# EAGLE design ecl-gated-ring-osc (EAGLE 9.4.1)
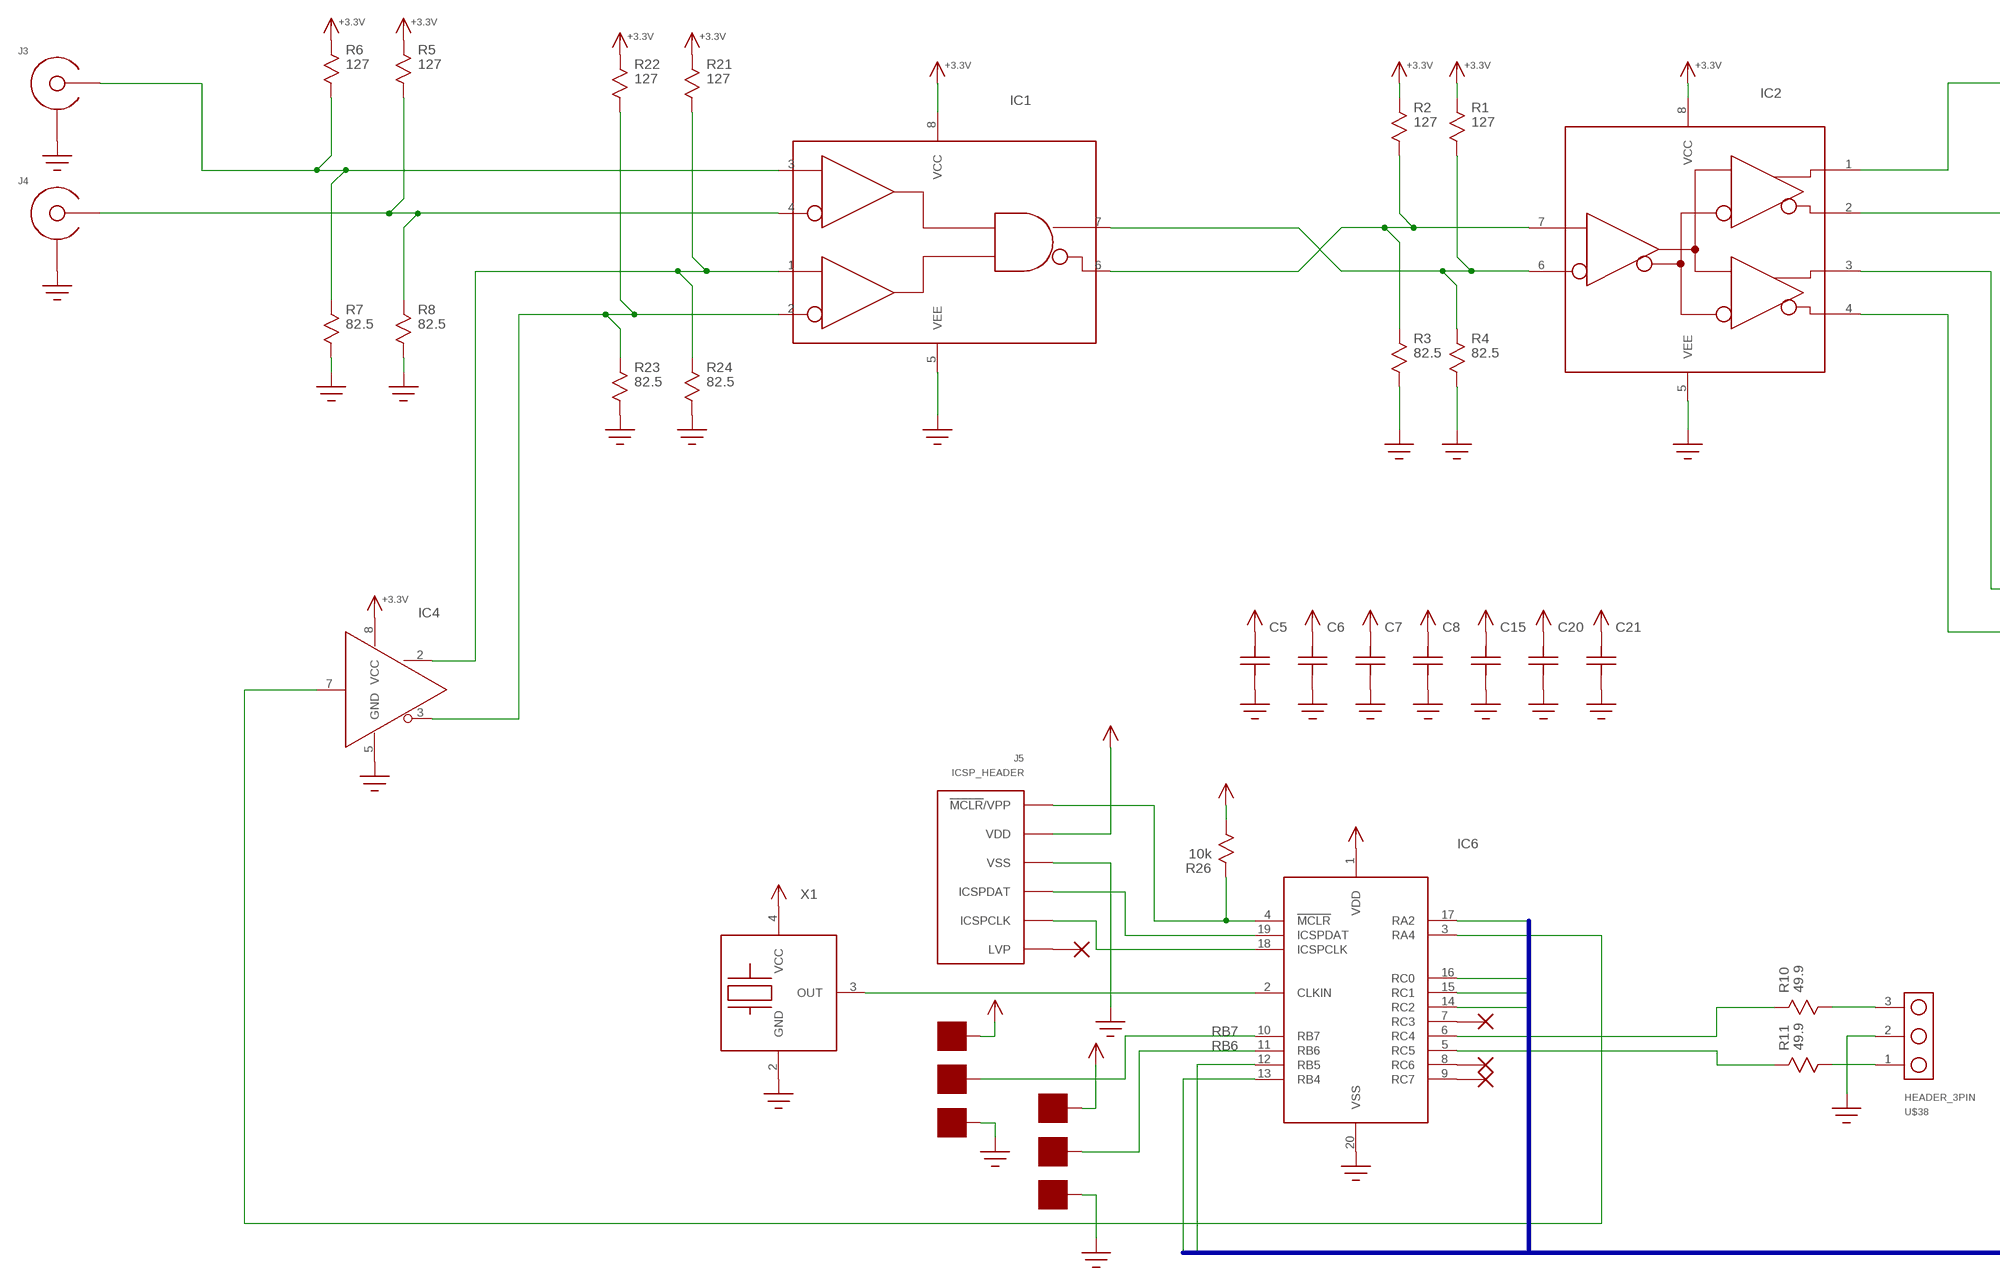
[diagram p0: schematic, sheet 1, part 1 of 2]
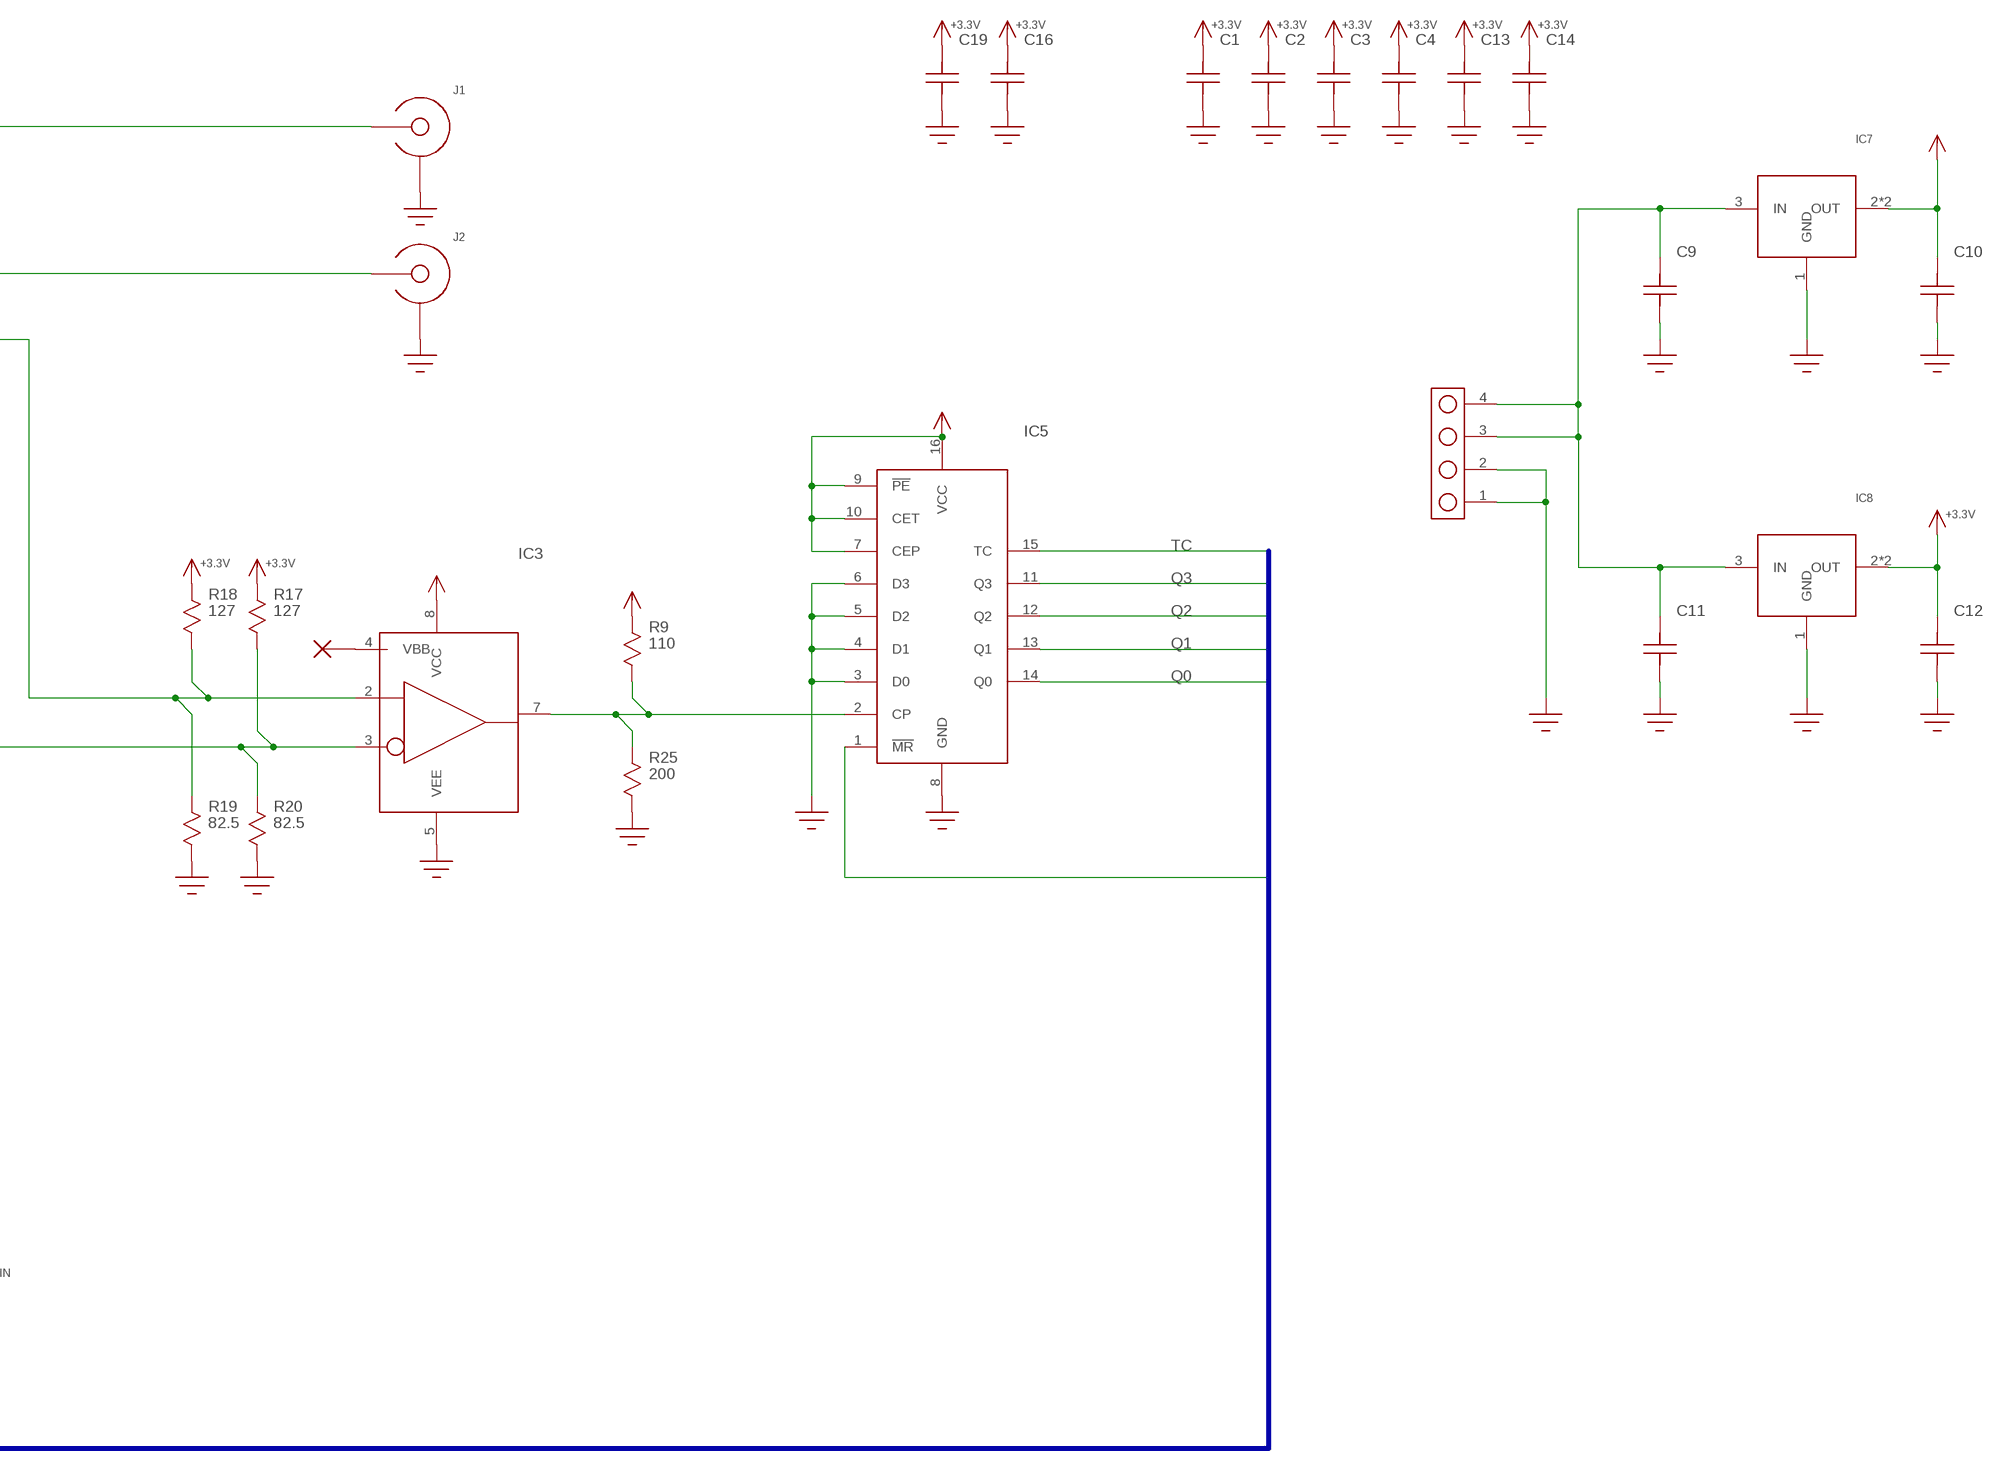
[diagram p1: schematic, sheet 1, part 2 of 2]

## Parts
C1  C0603  [C0603]
C2  C0603  [C0603]
C3  C0603  [C0603]
C4  C0603  [C0603]
C5  C0603  [C0603]
C6  C0603  [C0603]
C7  C0603  [C0603]
C8  C0603  [C0603]
C9  C1206  [1206]
C10  C1206  [1206]
C11  C1206  [1206]
C12  C1206  [1206]
C13  C0603  [C0603]
C14  C0603  [C0603]
C15  C0603  [C0603]
C16  C0603  [C0603]
C19  C0603  [C0603]
C20  C0603  [C0603]
C21  C0603  [C0603]
IC1  SY10EP05V  [SOIC8]
IC2  SY10EP11U  [SOIC8]
IC3  MC100EPT21  [SOIC8]
IC4  MC100LVELT20  [SOIC8]
IC5  74XX161  [SOIC-16]
IC6  PIC16F15345  [SOIC-20N]
IC7  AZ1117E  [SOT-223]
IC8  AZ1117E  [SOT-223]
J1  SMA-EDGE-LAUNCH4L-4020-TAPER-FIXED  [SMA_EDGE_LAUNCH_4L_4020_TAPER_FIXED]
J2  SMA-EDGE-LAUNCH4L-4020-TAPER-FIXED  [SMA_EDGE_LAUNCH_4L_4020_TAPER_FIXED]
J3  SMA-EDGE-LAUNCH4L-4020-TAPER-FIXED  [SMA_EDGE_LAUNCH_4L_4020_TAPER_FIXED]
J4  SMA-EDGE-LAUNCH4L-4020-TAPER-FIXED  [SMA_EDGE_LAUNCH_4L_4020_TAPER_FIXED]
J5  ICSP_HEADER  [HEADER_6PIN]
J6  HEADER_4PIN  [HEADER_4PIN]
R1  127  R0603  [R0603]
R2  127  R0603  [R0603]
R3  82.5  R0603  [R0603]
R4  82.5  R0603  [R0603]
R5  127  R0603  [R0603]
R6  127  R0603  [R0603]
R7  82.5  R0603  [R0603]
R8  82.5  R0603  [R0603]
R9  110  R0603  [R0603]
R10  49.9  R0603  [R0603]
R11  49.9  R0603  [R0603]
R17  127  R0603  [R0603]
R18  127  R0603  [R0603]
R19  82.5  R0603  [R0603]
R20  82.5  R0603  [R0603]
R21  127  R0603  [R0603]
R22  127  R0603  [R0603]
R23  82.5  R0603  [R0603]
R24  82.5  R0603  [R0603]
R25  200  R0603  [R0603]
R26  10k  R0603  [R0603]
U$38  HEADER_3PIN  [HEADER_3PIN]
U$73  PAD50MIL  [PAD_50MIL]
U$74  PAD50MIL  [PAD_50MIL]
U$75  PAD50MIL  [PAD_50MIL]
U$82  NO_CONNECT  (no package)
U$83  PAD50MIL  [PAD_50MIL]
U$84  PAD50MIL  [PAD_50MIL]
U$85  NO_CONNECT  (no package)
U$86  NO_CONNECT  (no package)
U$87  NO_CONNECT  (no package)
U$88  NO_CONNECT  (no package)
U$92  PAD50MIL  [PAD_50MIL]
X1  XTAL_OSC  [XTAL_3.2X5]

## Nets
!MR!: IC5.1(!MR!) IC6.12(RB5)
+3.3V: C1.P$2 C2.P$2 C3.P$2 C4.P$2 C12.P$2 C13.P$2 C14.P$2 C16.P$2 C19.P$2 IC1.8(VCC) IC2.8(VCC) IC4.8(VCC) IC8.2(OUT) IC8.4(OUT) R1.P$1 R2.P$1 R5.P$1 R6.P$1 R17.P$1 R18.P$1 R21.P$1 R22.P$1
GND: C1.P$1 C2.P$1 C3.P$1 C4.P$1 C5.P$1 C6.P$1 C7.P$1 C8.P$1 C9.P$1 C10.P$1 C11.P$1 C12.P$1 C13.P$1 C14.P$1 C15.P$1 C16.P$1 C19.P$1 C20.P$1 C21.P$1 IC1.5(VEE) IC2.5(VEE) IC3.5(VEE) IC4.5(GND) IC5.3(D0) IC5.4(D1) IC5.5(D2) IC5.6(D3) IC5.8(GND) IC6.20(VSS) IC7.1(GND) IC8.1(GND) J1.BOTTOM_GND(SHIELD) J1.GND@1(SHIELD) J1.GND@2(SHIELD) J1.GND@3(SHIELD) J1.GND@4(SHIELD) J1.GND@5(SHIELD) J1.GND@6(SHIELD) J1.GND@7(SHIELD) J1.GND@8(SHIELD) J1.GND@14(SHIELD) J1.GND@15(SHIELD) J1.GND@16(SHIELD) J1.GND@17(SHIELD) J1.GND_PAD1(SHIELD) J1.GND_PAD2(SHIELD) J1.P$1(SHIELD) J1.P$2(SHIELD) J2.BOTTOM_GND(SHIELD) J2.GND@1(SHIELD) J2.GND@2(SHIELD) J2.GND@3(SHIELD) J2.GND@4(SHIELD) J2.GND@5(SHIELD) J2.GND@6(SHIELD) J2.GND@7(SHIELD) J2.GND@8(SHIELD) J2.GND@14(SHIELD) J2.GND@15(SHIELD) J2.GND@16(SHIELD) J2.GND@17(SHIELD) J2.GND_PAD1(SHIELD) J2.GND_PAD2(SHIELD) J2.P$1(SHIELD) J2.P$2(SHIELD) J3.BOTTOM_GND(SHIELD) J3.GND@1(SHIELD) J3.GND@2(SHIELD) J3.GND@3(SHIELD) J3.GND@4(SHIELD) J3.GND@5(SHIELD) J3.GND@6(SHIELD) J3.GND@7(SHIELD) J3.GND@8(SHIELD) J3.GND@14(SHIELD) J3.GND@15(SHIELD) J3.GND@16(SHIELD) J3.GND@17(SHIELD) J3.GND_PAD1(SHIELD) J3.GND_PAD2(SHIELD) J3.P$1(SHIELD) J3.P$2(SHIELD) J4.BOTTOM_GND(SHIELD) J4.GND@1(SHIELD) J4.GND@2(SHIELD) J4.GND@3(SHIELD) J4.GND@4(SHIELD) J4.GND@5(SHIELD) J4.GND@6(SHIELD) J4.GND@7(SHIELD) J4.GND@8(SHIELD) J4.GND@14(SHIELD) J4.GND@15(SHIELD) J4.GND@16(SHIELD) J4.GND@17(SHIELD) J4.GND_PAD1(SHIELD) J4.GND_PAD2(SHIELD) J4.P$1(SHIELD) J4.P$2(SHIELD) J5.3(VSS) J6.1 J6.2 R3.P$2 R4.P$2 R7.P$2 R8.P$2 R19.P$2 R20.P$2 R23.P$2 R24.P$2 R25.P$2 U$38.2 U$83.P$1 U$92.P$1 X1.2(GND)
N$1: IC2.3(Q1) IC3.2(D) R18.P$2 R19.P$1
N$2: IC1.6(!Q!) IC2.7(D) R2.P$2 R3.P$1
N$3: IC1.4(!D1!) J4.CENTER@1(CENTER) J4.P$3(CENTER) R5.P$2 R8.P$1
N$4: IC1.3(D1) J3.CENTER@1(CENTER) J3.P$3(CENTER) R6.P$2 R7.P$1
N$5: IC1.7(Q) IC2.6(!D!) R1.P$2 R4.P$1
N$6: IC2.2(!Q0!) J2.CENTER@1(CENTER) J2.P$3(CENTER)
N$7: IC2.1(Q0) J1.CENTER@1(CENTER) J1.P$3(CENTER)
N$8: IC2.4(!Q1!) IC3.3(!D!) R17.P$2 R20.P$1
N$9: IC1.1(D0) IC4.2(Q) R21.P$2 R24.P$1
N$10: IC1.2(!D0!) IC4.3(!Q!) R22.P$2 R23.P$1
N$11: IC3.7(Q) IC5.2(CP) R9.P$2 R25.P$1
N$12: IC6.4(!MCLR!) J5.1(!MCLR!/VPP) R26.P$1
N$13: IC6.19(ICSPDAT) J5.4(ICSPDAT)
N$14: IC6.18(ICSPCLK) J5.5(ICSPCLK)
N$15: IC6.2(CLKIN) X1.3(OUT)
N$16: IC3.4(VBB) U$82.P$1
N$17: R10.P$2 U$38.3
N$18: R11.P$2 U$38.1
N$20: IC6.6(RC4) R10.P$1
N$21: IC6.5(RC5) R11.P$1
N$24: IC6.7(RC3) U$85.P$1
N$25: C9.P$2 C11.P$2 IC7.3(IN) IC8.3(IN) J6.3 J6.4
N$31: IC4.7(D) IC6.3(RA4)
N$32: IC6.8(RC6) U$86.P$1
N$33: IC6.9(RC7) U$87.P$1
N$36: J5.6(LVP) U$88.P$1
Q0: IC5.14(Q0) IC6.14(RC2)
Q1: IC5.13(Q1) IC6.15(RC1)
Q2: IC5.12(Q2) IC6.16(RC0)
Q3: IC5.11(Q3) IC6.17(RA2)
RB6: IC6.11(RB6) U$74.P$1
RB7: IC6.10(RB7) U$73.P$1
TC: IC5.15(TC) IC6.13(RB4)
VCC2: C5.P$2 C6.P$2 C7.P$2 C8.P$2 C10.P$2 C15.P$2 C20.P$2 C21.P$2 IC3.8(VCC) IC5.7(CEP) IC5.9(!PE!) IC5.10(CET) IC5.16(VCC) IC6.1(VDD) IC7.2(OUT) IC7.4(OUT) J5.2(VDD) R9.P$1 R26.P$2 U$75.P$1 U$84.P$1 X1.4(VCC)

## Buses
!MR!,Q0,Q1,Q2,Q3,TC

## Library data of the parts
C1-C16 C19-C21 = yapo:C
IC1 = yapo:SY10EP05V
IC2 = yapo:SY10EP11U
IC3 = yapo:MC100EPT21
IC4 = yapo:MC100LVELT20
IC5 = yapo:74XX161
IC6 = yapo:PIC16F15345
IC7 IC8 = yapo:AZ1117E
J1-J4 = sma_footprint_2l:SMA-EDGE-LAUNCH
J5 = yapo:ICSP_HEADER
J6 = yapo:HEADER_4PIN
R1-R11 R17-R26 = yapo:R
U$38 = yapo:HEADER_3PIN
U$73-U$75 U$83 U$84 U$92 = yapo:PAD
U$82 U$85-U$88 = yapo:NO_CONNECT
X1 = yapo:XTAL_OSC

## Board
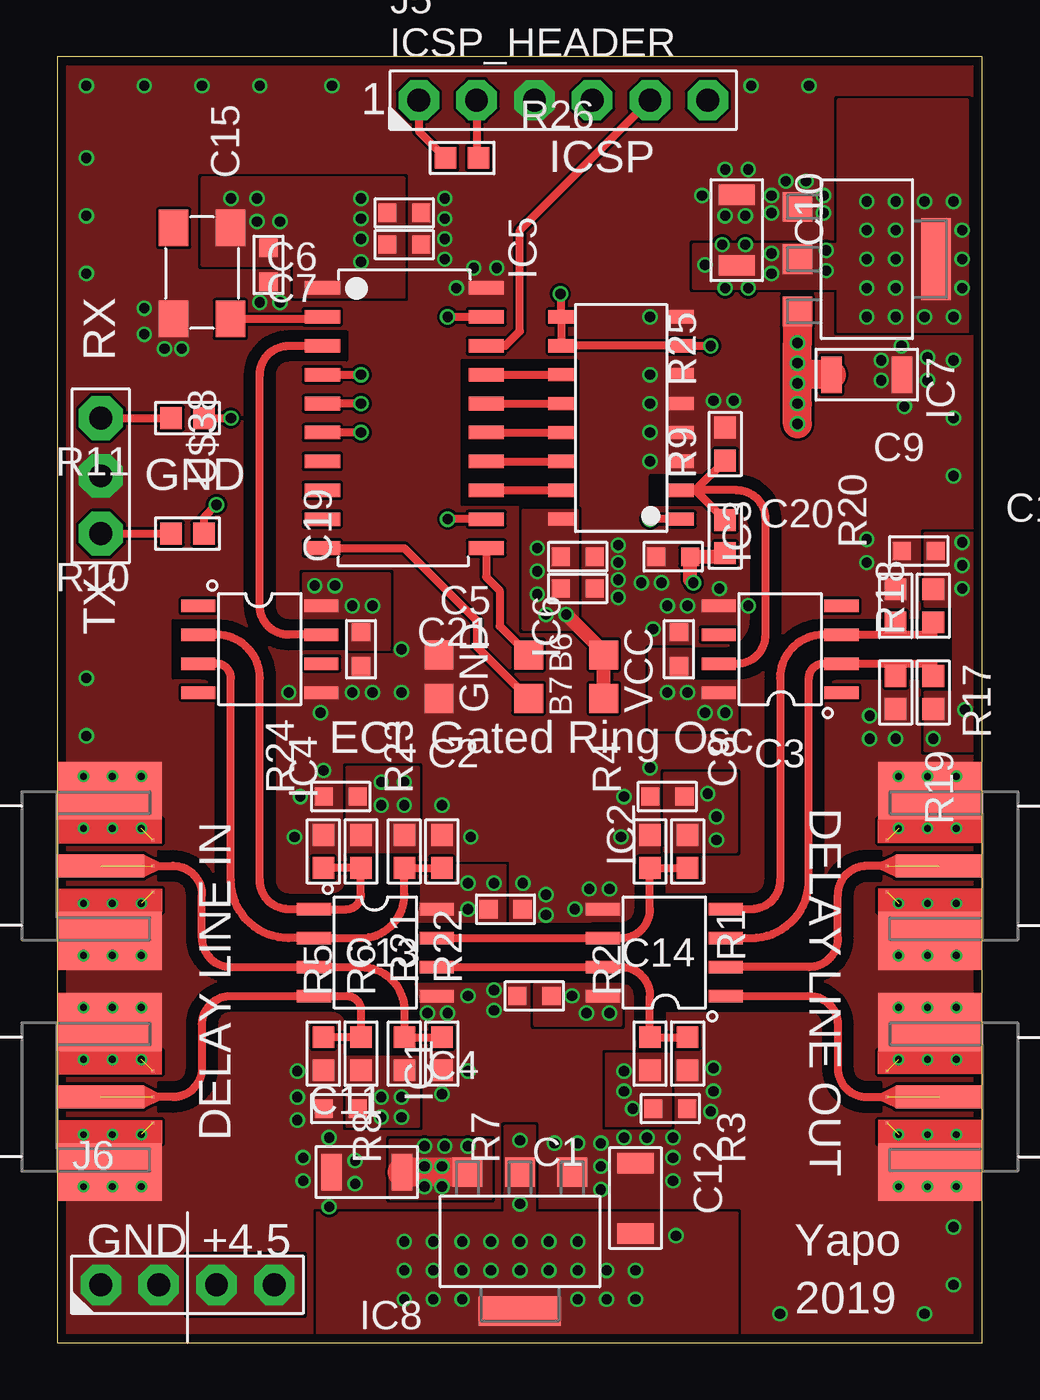
[diagram p2: board, top side]
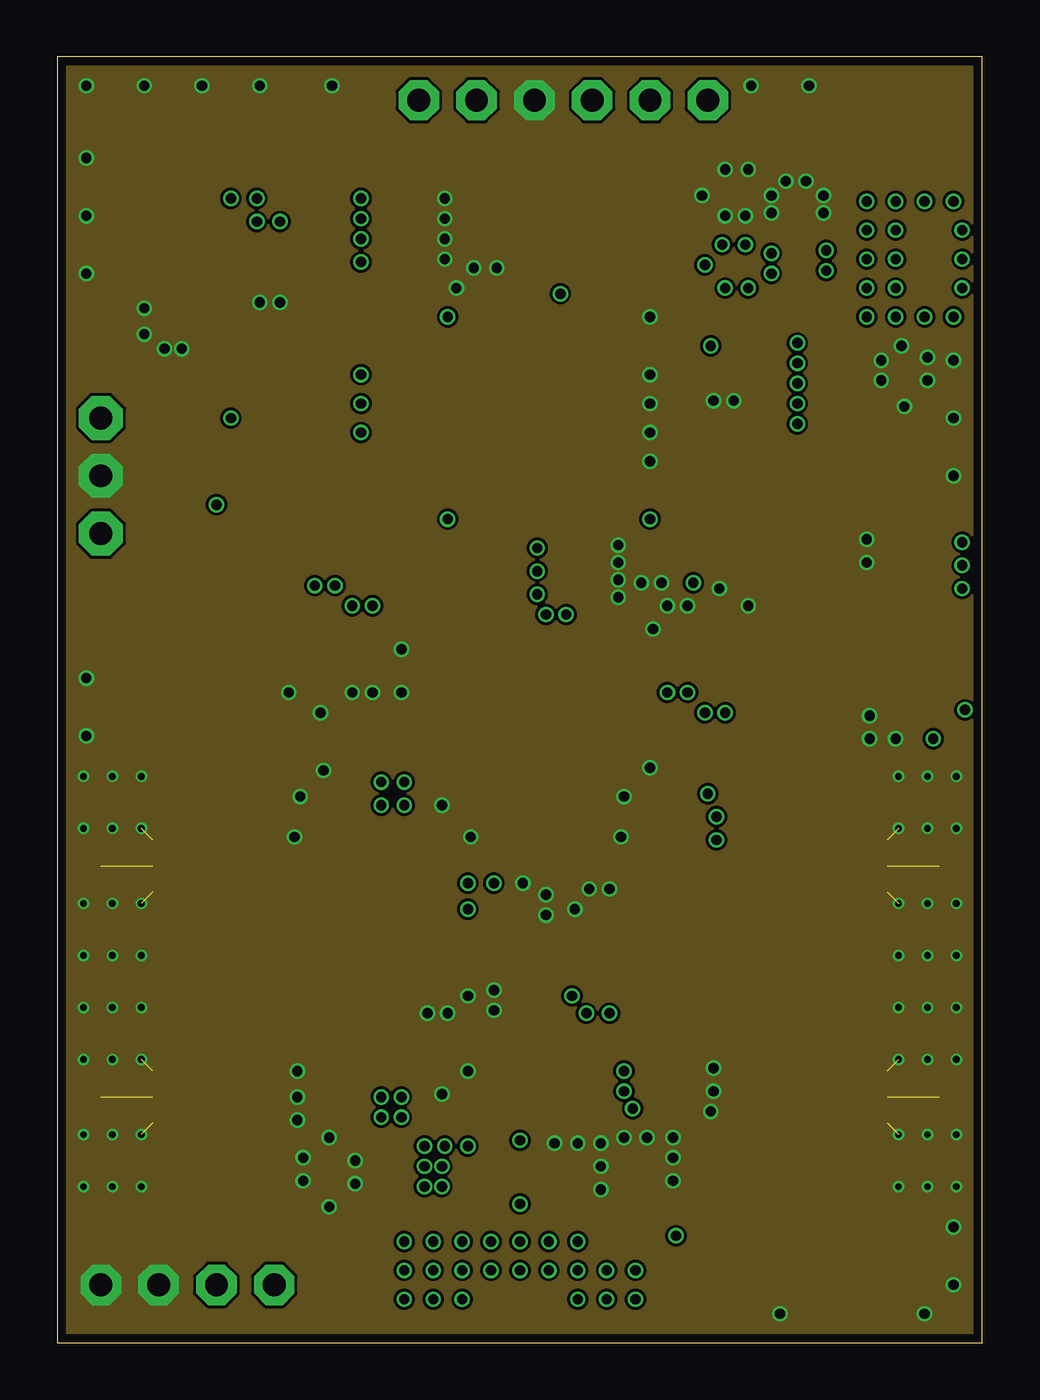
[diagram p3: board, inner layer Route2]
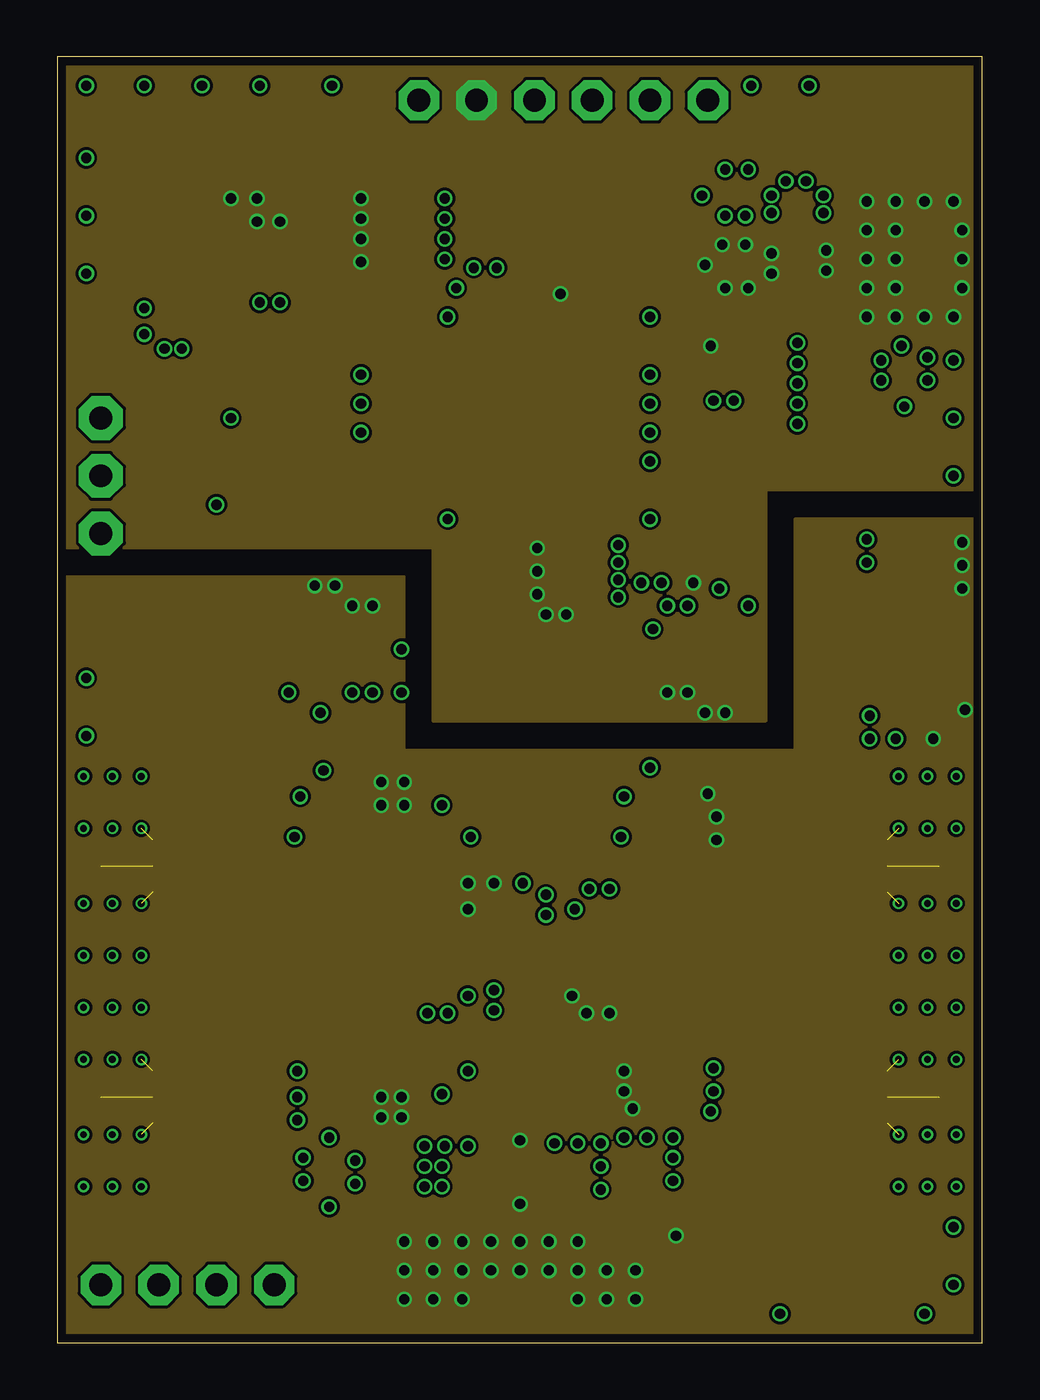
[diagram p4: board, inner layer Route15]
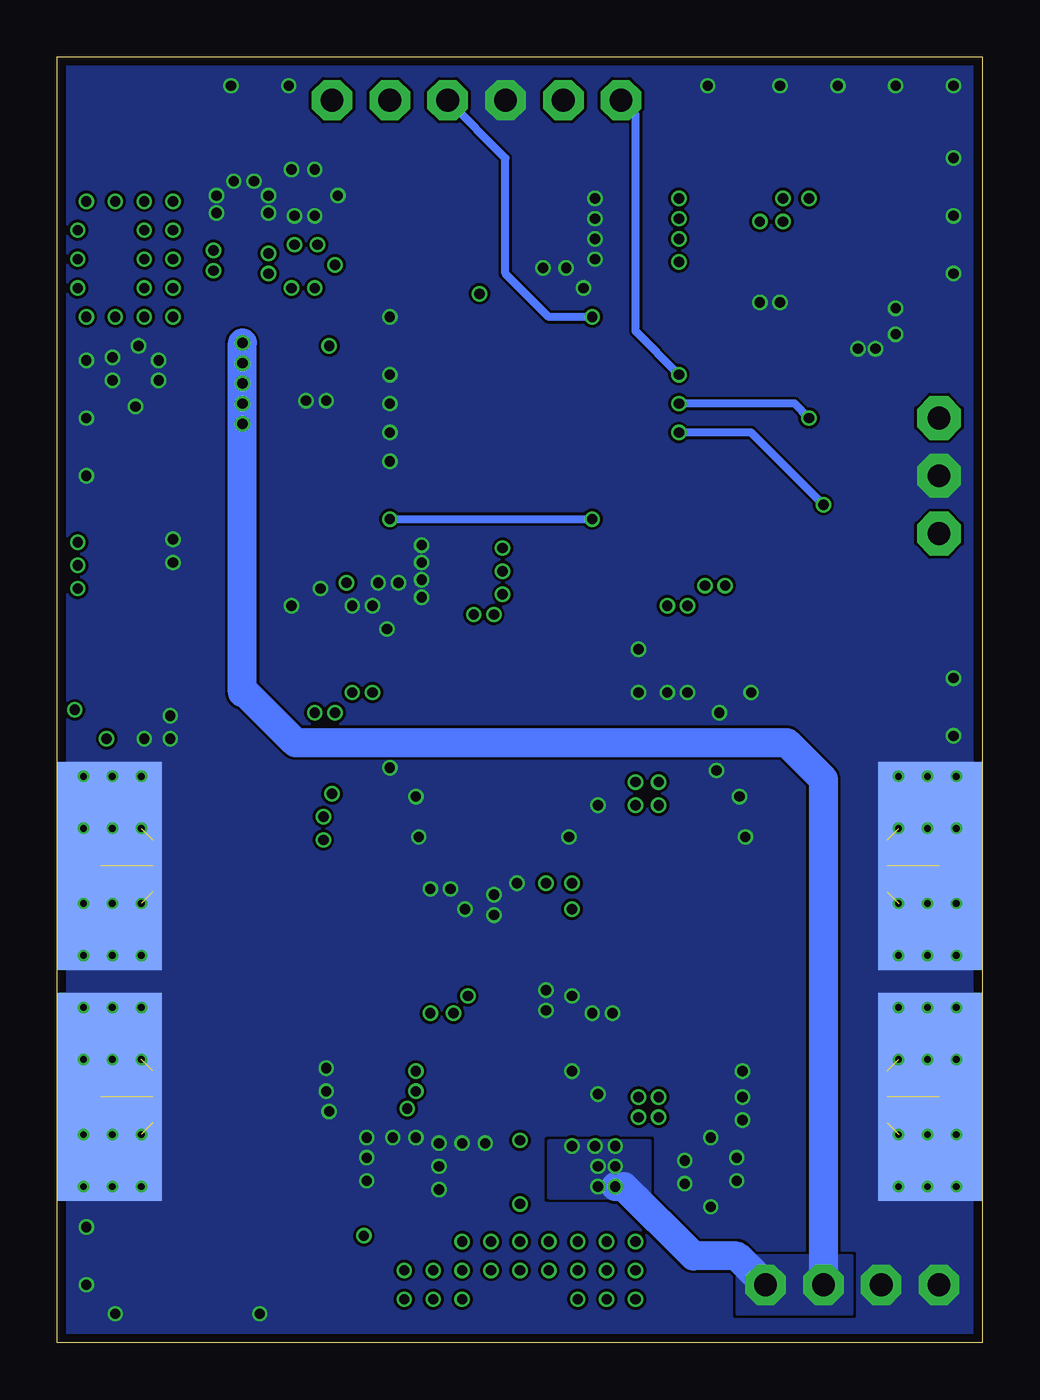
[diagram p5: board, bottom side, seen from below]

Size 40.64 x 56.52 mm. Coordinates in mm from the lower left corner, seen from the top.
Outline: 0,0 40.64,0 40.64,56.52 0,56.52 0,0
Copper layers (1*2*15*16): Top 0.035559375mm / dielectric 0.17018125mm / Route2 0.01778125mm / dielectric 47mil / Route15 0.01778125mm / dielectric 0.17018125mm / Bottom 0.035559375mm
Design rules "oshpark-4layer *": minimum track width 5mil, minimum drill 10mil, track to track 5mil, track to pad 5mil, pad to pad 5mil, via to via 5mil, smd to smd 5mil, copper to edge 15mil, drill to drill 6mil, minimum pad ring 4mil, minimum via ring 4mil, stop-mask expansion 2.5mil, vias tented up to drill 20mil, thermal gap 10mil

### Footprints (pad centres in the part's own frame; a part is rotated, then mirrored left to right if it is on the bottom)
C0603 = smd 0.8 x 0.8: P$1 -0.75,0; P$2 0.75,0
1206 = smd 0.9 x 1.6: P$1 -1.55,0; P$2 1.55,0
SOIC8 = smd 0.55 x 1.5: 1 -1.905,-2.7; 2 -0.635,-2.7; 3 0.635,-2.7; 4 1.905,-2.7; 5 1.905,2.7; 6 0.635,2.7; 7 -0.635,2.7; 8 -1.905,2.7
SOIC-16 = smd 0.58 x 1.12: 1 -4.445,-2.64; 2 -3.175,-2.64; 3 -1.905,-2.64; 4 -0.635,-2.64; 5 0.635,-2.64; 6 1.905,-2.64; 7 3.175,-2.64; 8 4.445,-2.64; 9 4.445,2.64; 10 3.175,2.64; 11 1.905,2.64; 12 0.635,2.64; 13 -0.635,2.64; 14 -1.905,2.64; 15 -3.175,2.64; 16 -4.445,2.64
SOIC-20N = smd 0.6 x 1.55: 1 -5.715,-3.6; 2 -4.445,-3.6; 3 -3.175,-3.6; 4 -1.905,-3.6; 5 -0.635,-3.6; 6 0.635,-3.6; 7 1.905,-3.6; 8 3.175,-3.6; 9 4.445,-3.6; 10 5.715,-3.6; 11 5.715,3.6; 12 4.445,3.6; 13 3.175,3.6; 14 1.905,3.6; 15 0.635,3.6; 16 -0.635,3.6; 17 -1.905,3.6; 18 -3.175,3.6; 19 -4.445,3.6; 20 -5.715,3.6
SOT-223 = smd 1.3 x 1.3: 1 -2.3,-3.05; 2 0,-3.05; 3 2.3,-3.05 | smd 3.6 x 1.3: 4 0,3.05
SMA_EDGE_LAUNCH_4L_4020_TAPER_FIXED = smd 4.572 x 9.144 bottom: BOTTOM_GND 2.286,0 | smd 3.81 x 1.016: CENTER@1 1.905,0 | drill 0.3: GND@1 1.143,3.937; GND@2 3.683,3.937; GND@3 1.143,1.651; GND@4 3.683,1.651; GND@5 1.143,-1.651; GND@6 3.683,-1.651; GND@7 1.143,-3.937; GND@8 3.683,-3.937; GND@14 2.413,3.937; GND@15 2.413,-3.937; GND@16 2.413,-1.651; GND@17 2.413,1.651 | smd 4.572 x 2.54: GND_PAD1 2.286,3.302; GND_PAD2 2.286,-3.302 | smd 0.127 x 0.127: P$1 4.191,1.143; P$2 4.191,-1.143; P$3 4.191,0
HEADER_6PIN = drill 1 pad 1.778 octagon: 1 -6.35,0; 2 -3.81,0; 3 -1.27,0; 4 1.27,0; 5 3.81,0; 6 6.35,0
HEADER_4PIN = drill 1 pad 1.778 octagon: 1 -3.81,0; 2 -1.27,0; 3 1.27,0; 4 3.81,0
R0603 = smd 0.95 x 0.95: P$1 -0.725,0; P$2 0.725,0
HEADER_3PIN = drill 1 pad 1.93 octagon: 1 -2.54,0; 2 0,0; 3 2.54,0
PAD_50MIL = smd 1.27 x 1.27: P$1 0,0
XTAL_3.2X5 = smd 1.6 x 1.3: 1 -2,-1.25; 2 2,-1.25; 3 2,1.25; 4 -2,1.25

### Placement (x,y rotation side)
C1  26.92,10.29 180 top
C2  12.45,24 0 top
C3  26.8,24 0 top
C4  12.45,10.29 0 top
C5  22.86,34.54 180 top
C6  15.24,49.66 180 top
C7  15.24,48.26 180 top
C8  27.3,30.48 270 top
C9  35.56,42.55 180 top
C10  29.84,48.9 270 top
C11  13.59,7.49 0 top
C12  25.4,6.35 270 top
C13  19.68,19.05 180 top
C14  20.95,15.24 0 top
C15  9.27,47.37 90 top
C16  37.85,34.8 0 top
C19  13.34,30.48 90 top
C20  27.05,34.54 0 top
C21  22.86,33.15 180 top
IC1  13.97,17.14 270 top
IC2  26.67,17.14 90 top
IC3  31.75,30.48 90 top
IC4  8.89,30.48 270 top
IC5  24.77,40.64 90 top
IC6  15.24,40.64 270 top
IC7  35.56,47.62 270 top
IC8  20.32,4.45 180 top
J1  40.64,10.79 180 top
J2  40.64,20.95 180 top
J3  0,20.95 0 top
J4  0,10.79 0 top
J5  22.23,54.61 0 top
J6  5.71,2.54 0 top
R1  27.69,21.59 270 top
R2  26.04,12.7 90 top
R3  27.69,12.7 270 top
R4  26.04,21.59 90 top
R5  13.34,12.7 90 top
R6  15.24,12.7 90 top
R7  16.89,12.7 270 top
R8  11.68,12.7 270 top
R9  29.34,35.43 90 top
R10  5.71,35.56 180 top
R11  5.71,40.64 180 top
R17  38.48,32.38 270 top
R18  38.48,28.57 90 top
R19  36.83,28.57 270 top
R20  36.83,32.38 90 top
R21  13.34,21.59 270 top
R22  15.24,21.59 270 top
R23  16.89,21.59 90 top
R24  11.68,21.59 90 top
R25  29.34,39.5 90 top
R26  17.78,52.07 0 top
U$38  1.91,38.1 270 top
U$73  20.7,28.32 0 top
U$74  20.7,30.23 0 top
U$75  24,28.32 0 top
U$83  16.76,30.23 0 top
U$84  24,30.23 0 top
U$92  16.76,28.32 0 top
X1  6.35,46.99 270 top

### Tracks (layer width: path | path; a pad name or v marks a point on that pad's centre or on a via)
!MR!  (via drill 0.45)
  Top 0.349: IC6.12 v17.14,36.2 | IC5.1 v26.04,36.2
  Bottom 0.349: v26.04,36.2 v17.14,36.2
+3.3V  (via drill 0.45)
  other vias: 12.95,32.38 13.84,32.38 12.19,33.27 11.3,33.27 14.22,23.62 15.24,23.62 15.24,24.64 14.22,24.64 28.57,24.13 28.96,23.11 28.96,22.1 18.03,19.05 19.18,20.19 18.03,20.19 22.61,15.24 24.26,14.48 23.24,14.48 14.22,10.79 15.11,10.79 14.22,9.91 15.11,9.91 24.89,11.94 25.27,10.29 24.89,11.05 39.75,35.18 39.75,34.16 39.75,33.15 39.88,27.81 38.48,26.54 19.05,3.17 20.32,3.17 21.59,3.17 17.78,3.17 22.86,3.17 22.86,1.91 17.78,1.91 16.51,1.91 24.13,1.91 24.13,3.17 16.51,3.17 15.24,1.91 15.24,3.17 25.4,3.17 25.4,1.91 22.86,4.45 21.59,4.45 20.32,4.45 19.05,4.45 17.78,4.45 16.51,4.45 15.24,4.45 20.32,6.1 20.32,8.89 27.18,4.7
  pour Top (no thermals): 10.79,30.48 14.61,30.48 14.61,33.78 10.79,33.78
  pour Top (no thermals): 12.7,25.27 12.7,21.59 15.88,21.59 15.88,25.27
  pour Top (no thermals): 26.67,25.02 26.67,21.59 29.84,21.59 29.84,25.02
  pour Top (no thermals): 15.88,18.41 19.68,18.41 19.68,20.95 15.88,20.95
  pour Top (no thermals): 20.95,15.88 20.95,13.97 24.77,13.97 24.77,15.88
  pour Top (no thermals): 12.7,12.7 12.7,9.53 15.88,9.53 15.88,12.7
  pour Top (no thermals): 24.13,12.7 26.92,12.7 26.92,9.53 24.13,9.53
  pour Route15 (no thermals): 0,0 40.64,0 40.64,36.2 32.38,36.2 32.38,26.04 15.24,26.04 15.24,33.66 0,33.66
  pour Top (no thermals): 38.1,35.56 38.1,32.38 39.37,32.38 39.37,28.57 38.1,28.57 38.1,26.04 40.64,26.04 40.64,35.56
  pour Top (no thermals): 19.68,9.53 20.95,9.53 20.95,5.71 29.84,5.71 29.84,0 11.43,0 11.43,5.71 19.68,5.71
GND  (via drill 0.45)  (8 unrouted)
  other vias: 5.46,43.69 3.81,44.32 18.29,47.24 17.53,46.35 17.02,50.29 17.02,48.51 17.02,49.4 17.02,47.62 8.89,45.72 9.78,45.72 4.7,43.69 19.3,47.24 26.04,42.55 26.04,41.27 26.04,40.01 26.04,38.73 26.04,45.09 24.64,35.05 24.64,34.29 24.64,33.53 24.64,32.77 26.54,33.4 25.65,33.4 27.69,32.38 26.8,32.38 12.95,28.57 13.84,28.57 10.16,28.57 11.56,27.69 30.35,32.38 29.08,33.15 28.83,41.4 29.72,41.4 11.68,25.15 10.67,24 10.41,22.23 18.16,22.23 16.89,23.62 26.04,25.27 24.89,24 24.77,22.23 20.45,20.19 21.46,19.68 21.46,18.8 22.73,19.05 23.37,19.94 24.26,19.94 18.03,15.24 19.18,15.49 19.18,14.61 16.26,14.48 17.14,14.48 10.54,11.94 10.54,10.79 10.54,9.78 18.03,11.94 16.89,10.92 28.83,12.06 28.83,11.05 28.7,10.16 26.16,31.37 32,51.05 32.89,51.05 33.66,50.42 33.66,49.66 31.37,50.42 31.37,49.66 30.23,49.53 29.34,49.53 29.34,51.56 30.35,51.56 28.32,50.42 37.08,43.81 36.2,43.18 36.2,42.29 37.21,41.15 38.23,43.31 38.23,42.29 35.69,26.54 35.56,35.31 36.83,26.54 35.56,34.29 35.69,27.56 21.84,8.76 22.86,8.76 23.88,8.76 24.89,9.02 25.91,9.02 27.05,9.02 27.05,8.13 27.05,7.11 23.88,7.75 23.88,6.73 10.79,8.13 10.79,7.11 13.08,8 13.08,6.99 11.94,5.97 11.94,9.02 1.27,26.67 1.27,29.21 1.27,46.99 1.27,49.53 1.27,52.07 1.27,55.24 3.81,55.24 6.35,55.24 8.89,55.24 12.06,55.24 30.48,55.24 33.02,55.24 39.37,43.18 39.37,40.64 39.37,38.1 39.37,5.08 39.37,2.54 38.1,1.27 31.75,1.27 3.81,45.47 15.11,30.48 15.11,28.57
  pour Top (rank 2, no thermals): 0,0 0,56.52 40.64,56.52 40.64,0
  pour Route2 (no thermals): 0,0 0,56.52 40.64,56.52 40.64,0
  cutout Top (no thermals): 13.97,18.41 26.67,18.41 26.67,15.88 13.97,15.88
  cutout Top (no thermals): 26.67,14.61 33.02,14.61 arc-90 33.66,13.97 33.66,12.06 arc90 35.56,10.16 36.2,10.16 36.2,11.43 35.56,11.43 arc-90 34.92,12.06 34.92,13.97 arc90 33.02,15.88 26.67,15.88
  cutout Top (no thermals): 26.67,15.88 33.02,15.88 arc90 34.92,17.78 34.92,19.68 arc-90 35.56,20.32 36.2,20.32 36.2,21.59 35.56,21.59 arc90 33.66,19.68 33.66,17.78 arc-90 33.02,17.14 26.67,17.14
  cutout Top (no thermals): 12.06,14.61 7.62,14.61 arc90 6.99,13.97 6.99,12.06 arc-90 5.08,10.16 4.45,10.16 4.45,11.43 5.08,11.43 arc90 5.71,12.06 5.71,13.97 arc-90 7.62,15.88 12.06,15.88
  cutout Top (no thermals): 12.06,15.88 7.62,15.88 arc-90 5.71,17.78 5.71,19.68 arc90 5.08,20.32 4.45,20.32 4.45,21.59 5.08,21.59 arc-90 6.99,19.68 6.99,17.78 arc90 7.62,17.14 12.06,17.14
  cutout Top (no thermals): 12.06,17.14 13.34,17.14 arc90 15.88,19.68 15.88,20.32 14.61,20.32 14.61,19.68 arc-90 13.34,18.41 12.06,18.41
  cutout Top (no thermals): 12.06,18.41 12.7,18.41 arc90 13.97,19.68 13.97,20.32 12.7,20.32 arc-90 12.06,19.68
  cutout Top (no thermals): 12.06,17.14 10.16,17.14 arc-90 6.99,20.32 6.99,28.57 arc90 6.35,29.21 5.08,29.21 5.08,31.75 6.99,31.75 arc-90 9.53,29.21 9.53,20.32 arc90 10.16,19.68 12.06,19.68
  cutout Top (no thermals): 26.67,17.14 30.48,17.14 arc90 33.66,20.32 33.66,28.57 arc-90 34.29,29.21 38.73,29.21 38.73,31.75 33.66,31.75 arc90 31.11,29.21 31.11,20.32 arc-90 30.48,19.68 26.67,19.68
  cutout Top (no thermals): 12.06,14.61 arc-90 12.7,13.97 12.7,12.7 15.88,12.7 15.88,14.61 arc90 13.34,17.14 12.06,17.14
  cutout Top (no thermals): 23.5,17.14 24.77,17.14 arc90 26.67,19.05 26.67,20.95 25.4,20.95 25.4,19.05 arc-90 24.77,18.41 23.5,18.41
  cutout Top (no thermals): 23.5,17.14 24.77,17.14 arc-90 26.67,15.24 26.67,13.34 25.4,13.34 25.4,15.24 arc90 24.77,15.88 23.5,15.88
  cutout Top (no thermals): 27.94,29.21 29.84,29.21 arc90 31.75,31.11 31.75,36.2 arc90 29.84,38.1 26.04,38.1 26.04,36.83 29.21,36.83 arc-90 30.48,35.56 30.48,31.75 arc-90 29.21,30.48 27.94,30.48
  pour Bottom (rank 2, no thermals): 0,0 40.64,0 40.64,56.52 0,56.52
  cutout Top (no thermals): 10.79,30.48 10.16,30.48 arc-90 8.26,32.38 8.26,42.55 arc-90 10.16,44.45 12.7,44.45 12.7,43.18 10.16,43.18 arc90 9.53,42.55 9.53,32.38 arc90 10.16,31.75 12.7,31.75 12.7,30.48
  cutout Top (no thermals): 17.78,43.18 22.86,43.18 22.86,36.83 17.78,36.83
N$1
  Top 0.349: IC2.3 30.48,17.78 arc90 33.02,20.32 33.02,29.21 arc-90 33.66,29.84 IC3.2 36.83,29.84 | 36.83,29.84 38.48,29.84 R18.P$2 | R19.P$1 36.83,29.84
N$2
  Top 0.349: IC1.6 IC2.7 24.77,16.51 arc-90 26.04,15.24 R2.P$2 R3.P$1
N$3  (1 unrouted)
  Top 0.349: J4.P$3 5.08,10.79 arc90 6.35,12.06 6.35,13.97 arc-90 7.62,15.24 IC1.4 12.7,15.24 arc-90 13.34,14.61 R5.P$2 R8.P$1
N$4  (1 unrouted)
  Top 0.349: J3.P$3 5.08,20.95 arc-90 6.35,19.68 6.35,17.78 arc90 7.62,16.51 IC1.3 13.34,16.51 arc-90 15.24,14.61 R6.P$2 R7.P$1
N$5
  Top 0.349: IC1.7 IC2.6 24.77,17.78 arc90 26.04,19.05 R4.P$1 R1.P$2
N$6  (1 unrouted)
  Top 0.349: J2.P$3 35.56,20.95 arc90 34.29,19.68 34.29,17.78 arc-90 33.02,16.51 IC2.2
N$7  (1 unrouted)
  Top 0.349: IC2.1 33.02,15.24 arc-90 34.29,13.97 34.29,12.06 arc90 35.56,10.79 J1.P$3
N$8
  Top 0.349: IC2.4 30.48,19.05 arc90 31.75,20.32 31.75,29.21 arc-90 33.66,31.11 IC3.3 36.83,31.11 | 36.83,31.11 38.48,31.11 R17.P$2 | R20.P$1 36.83,31.11
N$9
  Top 0.349: IC4.2 6.99,31.11 arc-90 8.89,29.21 8.89,20.32 arc90 10.16,19.05 IC1.1 12.7,19.05 arc90 13.34,19.68 R21.P$2 R24.P$1
N$10
  Top 0.349: IC4.3 6.99,29.84 arc-90 7.62,29.21 7.62,20.32 arc90 10.16,17.78 IC1.2 13.34,17.78 arc90 15.24,19.68 R22.P$2 R23.P$1
N$11
  Top 0.349: IC3.7 29.84,29.84 arc90 31.11,31.11 31.11,36.2 arc90 29.84,37.47 IC5.2 28.03,37.47 | 28.03,37.47 R25.P$1 | 28.03,37.47 R9.P$2
N$12  (via drill 0.45)
  Top 0.349: J5.1 15.88,53.25 R26.P$1 | IC6.4 v13.34,42.55
  Bottom 0.349: v13.34,42.55 15.24,44.45 15.24,53.98 J5.1
N$13  (via drill 0.45)
  Top 0.349: IC6.19 v17.14,45.09
  Bottom 0.349: v17.14,45.09 19.05,45.09 20.95,46.99 20.95,52.07 J5.4
N$14
  Top 0.349: IC6.18 19.68,43.81 20.32,44.45 20.32,48.9 J5.5
N$15
  Top 0.349: IC6.2 11.54,44.99 X1.3
N$17
  Top 0.349: U$38.3 R10.P$2
N$18
  Top 0.349: U$38.1 R11.P$2
N$20  (via drill 0.45)
  Top 0.349: R10.P$1 6.44,36.28 v6.99,36.83 | v13.34,40.01 IC6.6
  Bottom 0.349: v6.99,36.83 10.16,40.01 v13.34,40.01
N$21  (via drill 0.45)
  Top 0.349: R11.P$1 v7.62,40.64 | v13.34,41.27 IC6.5
  Bottom 0.349: v7.62,40.64 8.26,41.27 v13.34,41.27
N$25  (via drill 0.45)
  Top 1.27: IC7.3 v32.51,43.94 v32.51,43.05 | IC8.3 C11.P$2 | C9.P$2 32.51,42.55 v32.51,43.05 | v32.51,40.38 v32.51,41.27 v32.51,42.16 v32.51,43.05
  Bottom 1.27: J6.3 6.99,24.77 8.59,26.37 30.18,26.37 32.38,28.57 32.51,28.57 v32.51,43.94 | J6.4 10.79,3.81 12.7,3.81 15.75,6.86 v16.13,6.86
  other vias: 16.13,8.64 17.02,8.64 18.03,8.64 16.89,6.86 16.89,7.75 16.13,7.75
  pour Top (no thermals): 14.61,6.35 19.05,6.35 19.05,8.89 14.61,8.89
  pour Bottom (no thermals): 14.61,6.35 19.05,6.35 19.05,8.89 14.61,8.89
  pour Top (no thermals): 5.71,1.27 10.79,1.27 10.79,3.81 5.71,3.81
  pour Bottom (no thermals): 5.71,3.81 10.79,3.81 10.79,1.27 5.71,1.27
N$31
  Top 0.349: IC4.7 10.16,31.11 arc-90 8.89,32.38 8.89,42.55 arc-90 10.16,43.81 IC6.3
Q0
  Top 0.349: IC6.14 IC5.14
Q1
  Top 0.349: IC6.15 IC5.13
Q2
  Top 0.349: IC6.16 IC5.12
Q3
  Top 0.349: IC6.17 IC5.11
RB6
  Top 0.349: IC6.11 18.84,33.66 19.43,33.06 19.43,31.5 U$74.P$1
RB7
  Top 0.349: IC6.10 15.24,34.92 18.41,31.75 18.41,30.61 U$73.P$1
TC
  Top 0.349: IC6.13 IC5.15
VCC2  (via drill 0.45)
  Top 0.349: R26.P$2 18.41,52.16 J5.2 | v22.1,46.1 22.12,46.07 IC5.9 IC5.10 IC5.7 v28.7,43.81
  Top 0.61: v27.94,33.4 27.8,33.54 C20.P$2 29.17,34.54 R9.P$1 | U$75.P$1 U$84.P$1 24,30.35 v22.35,32
  other vias: 13.34,50.29 13.34,49.4 13.34,48.51 13.34,47.5 8.76,49.28 9.78,49.28 7.62,50.29 21.46,32 21.08,32.89 21.08,34.92 21.08,33.91 27.69,28.57 26.8,28.57 28.45,27.69 29.34,27.69 28.45,47.37 29.21,48.26 30.23,48.26 29.34,46.35 30.35,46.35 31.37,47.88 31.37,46.99 33.78,48.01 33.78,47.12 39.37,45.09 38.1,45.09 39.75,46.35 39.75,47.62 39.75,48.9 39.37,50.16 38.1,50.16 36.83,50.16 35.56,50.16 36.83,48.9 36.83,47.62 36.83,46.35 36.83,45.09 35.56,48.9 35.56,47.62 35.56,46.35 35.56,45.09 8.76,50.29
  pour Top (no thermals): 10.41,45.97 15.24,45.97 15.24,51.18 6.35,51.18 6.35,47.37 10.41,47.37
  pour Top (no thermals): 22.86,31.37 22.86,36.58 20.45,36.58 20.45,31.37
  pour Top (no thermals): 26.04,30.48 29.84,30.48 29.84,26.92 26.04,26.92
  pour Route15 (no thermals): 0,56.52 40.64,56.52 40.64,37.47 31.11,37.47 31.11,27.3 16.51,27.3 16.51,34.92 0,34.92
  pour Top (no thermals): 27.94,46.35 34.29,46.35 34.29,44.45 40.01,44.45 40.01,54.61 34.29,54.61 34.29,48.26 27.94,48.26

### Text on the board
tPlace: 1 | ICSP | RX | GND | TX | B6 | GND | B7 | VCC | ECL Gated Ring Osc | DELAY LINE OUT | DELAY LINE IN | GND | +4.5 | Yapo | 2019